# Altium schematic sheet MicroController.SchDoc
size A3; SheetNumber: 3; SheetTotal: 4
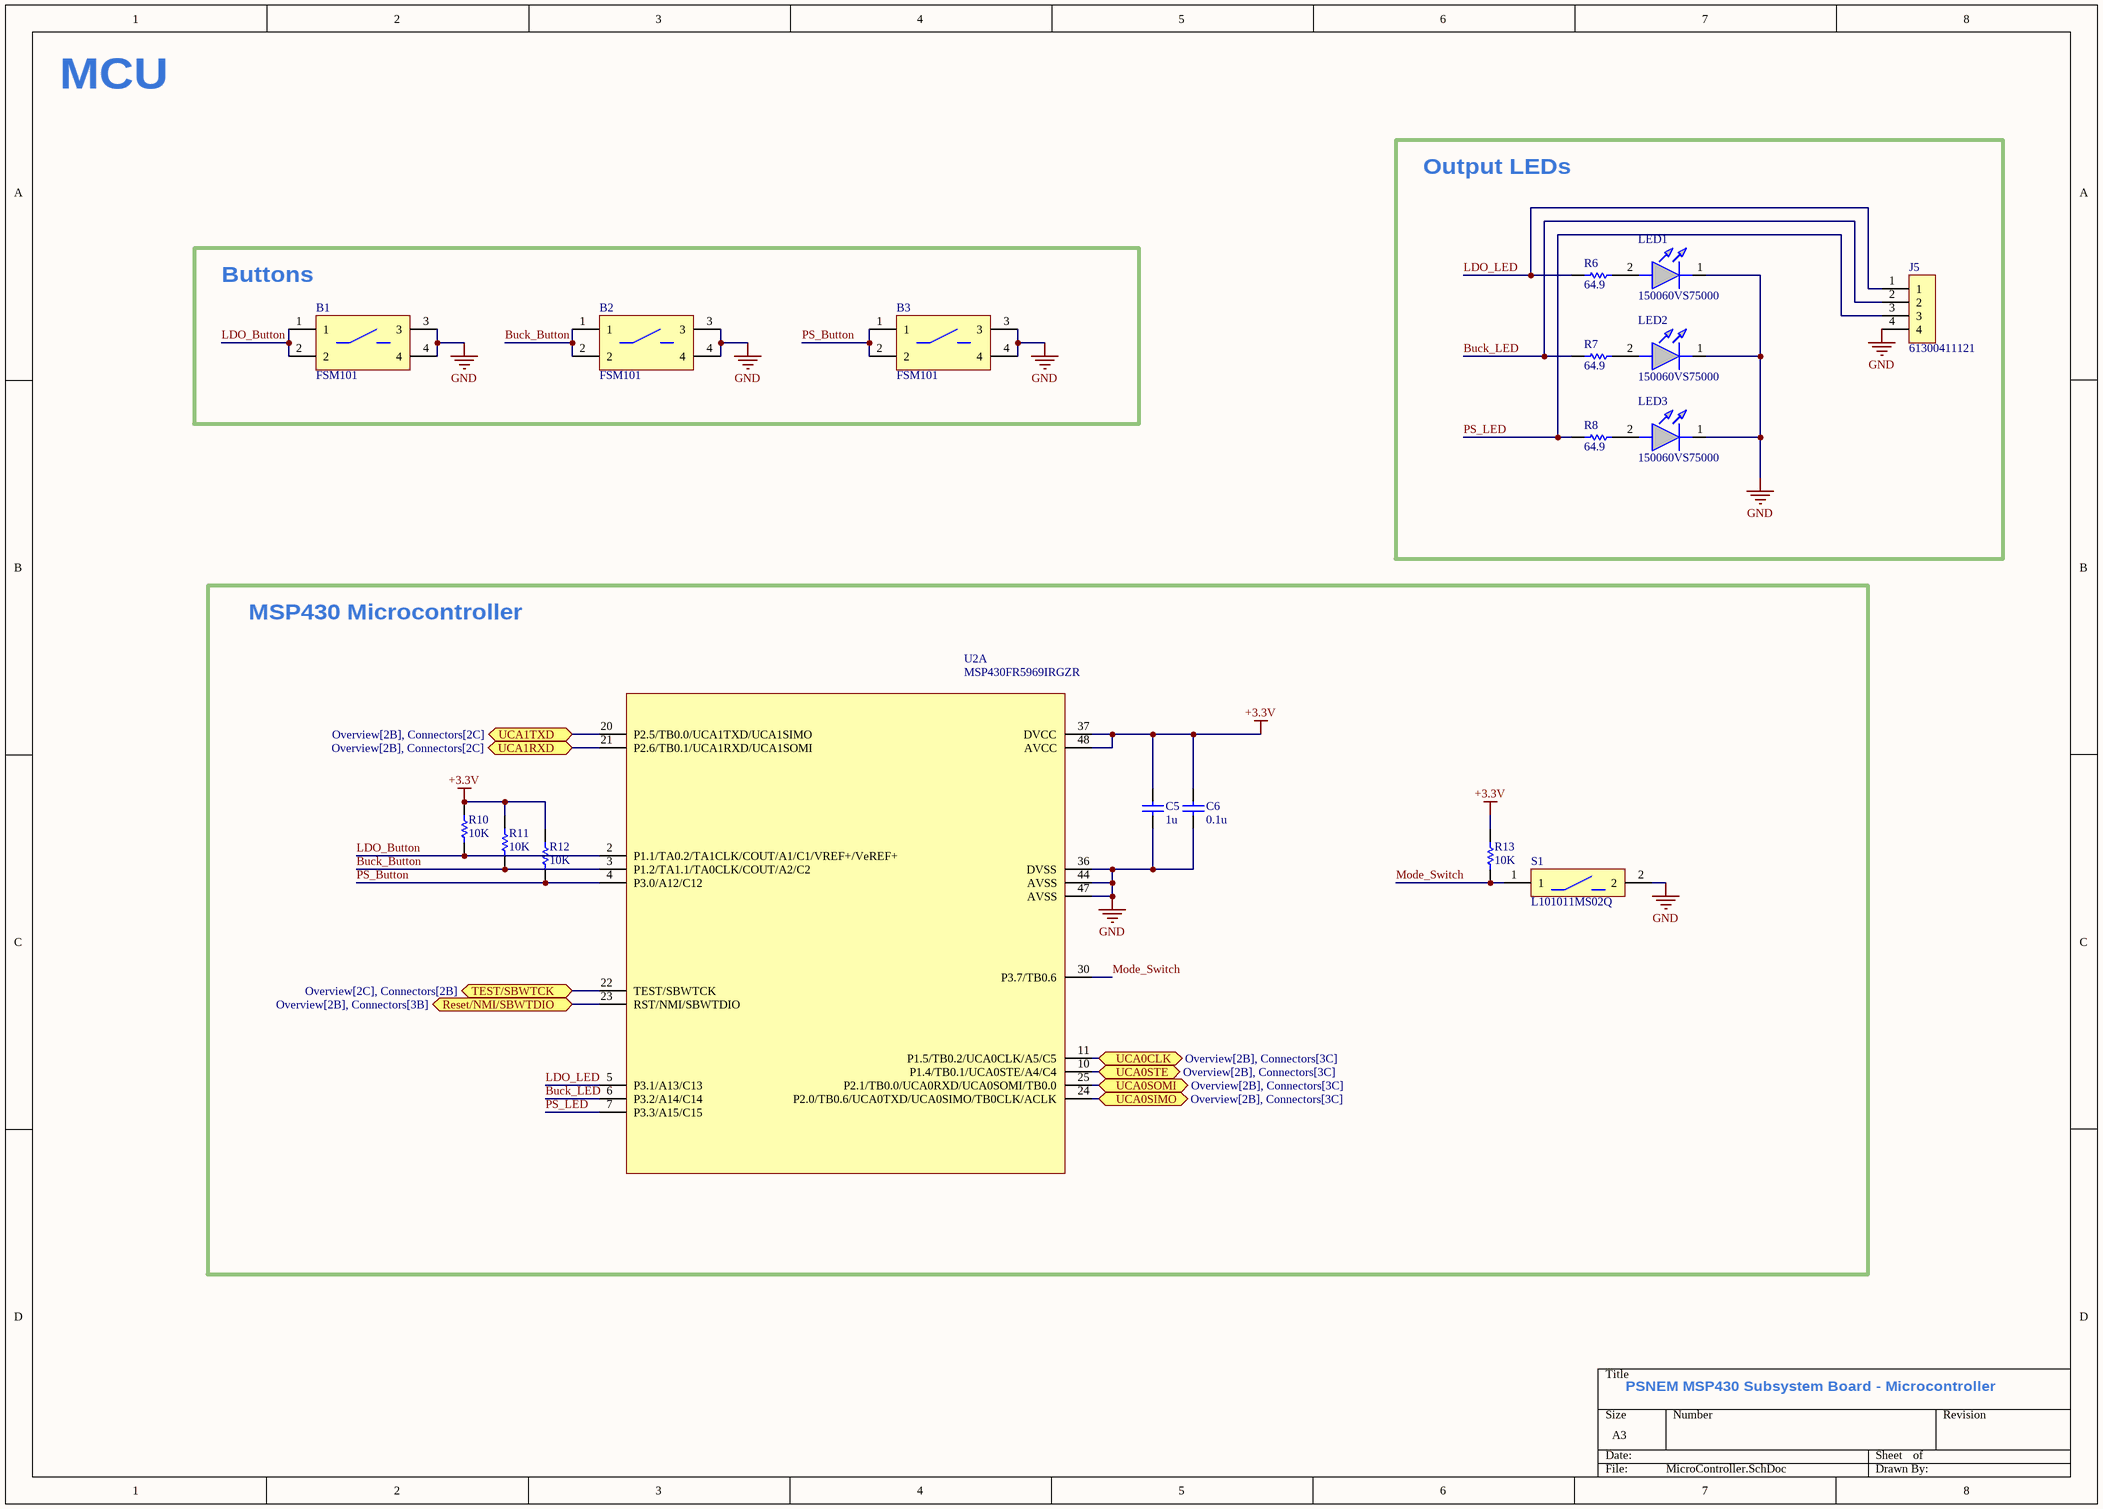
[diagram p0: MicroController.SchDoc]

## Parts
B1  FSM101  [FSM101]
B2  FSM101  [FSM101]
B3  FSM101  [FSM101]
C5  1u  [0805 Cap]
C6  0.1u  [0805 Cap]
J5  61300411121  [61300411121]
LED1  150060VS75000  [150060VS75000]
LED2  150060VS75000  [150060VS75000]
LED3  150060VS75000  [150060VS75000]
R6  64.9  [RESC1608X06N]
R7  64.9  [RESC1608X06N]
R8  64.9  [RESC1608X06N]
R10  10K  [RESC1608X06N]
R11  10K  [RESC1608X06N]
R12  10K  [RESC1608X06N]
R13  10K  [RESC1608X06N]
S1  L101011MS02Q  [L101011MS02Q]
U2  MSP430FR5969IRGZR  [MSP430FR5969IRGZR]  (part A of 2)

## Blocks framed on the sheet
Output LEDs: J5 LED1-LED3 R6-R8
Buttons: B1-B3
MSP430 Microcontroller: C5 C6 R10-R13 S1 U2

## Ports
Reset/NMI/SBWTDIO (bidir, see Overview[2B], Connectors[3B]), TEST/SBWTCK (bidir, see Overview[2C], Connectors[2B]), UCA0CLK (bidir, see Overview[2B], Connectors[3C]), UCA0SIMO (bidir, see Overview[2B], Connectors[3C]), UCA0SOMI (bidir, see Overview[2B], Connectors[3C]), UCA0STE (bidir, see Overview[2B], Connectors[3C]), UCA1RXD (bidir, see Overview[2B], Connectors[2C]), UCA1TXD (bidir, see Overview[2B], Connectors[2C])

## Nets
+3.3V: C5.2 C6.2 R10.2 R11.2 R12.2 R13.2 U2.37(DVCC) U2.48(AVCC)
GND: B1.3 B1.4 B2.3 B2.4 B3.3 B3.4 C5.1 C6.1 J5.4 LED1.1(K) LED2.1(K) LED3.1(K) S1.2 U2.36(DVSS) U2.44(AVSS) U2.47(AVSS)
Buck_Button: B2.1 B2.2 R11.1 U2.3(P1.2/TA1.1/TA0CLK/COUT/A2/C2)
Buck_LED: J5.2 R7.1 U2.6(P3.2/A14/C14)
LDO_Button: B1.1 B1.2 R10.1 U2.2(P1.1/TA0.2/TA1CLK/COUT/A1/C1/VREF+/VeREF+)
LDO_LED: J5.1 R6.1 U2.5(P3.1/A13/C13)
Mode_Switch: R13.1 S1.1 U2.30(P3.7/TB0.6)
PS_Button: B3.1 B3.2 R12.1 U2.4(P3.0/A12/C12)
PS_LED: J5.3 R8.1 U2.7(P3.3/A15/C15)
Reset/NMI/SBWTDIO: U2.23(RST/NMI/SBWTDIO) ; port Reset/NMI/SBWTDIO
TEST/SBWTCK: U2.22(TEST/SBWTCK) ; port TEST/SBWTCK
UCA0CLK: U2.11(P1.5/TB0.2/UCA0CLK/A5/C5) ; port UCA0CLK
UCA0SIMO: U2.24(P2.0/TB0.6/UCA0TXD/UCA0SIMO/TB0CLK/ACLK) ; port UCA0SIMO
UCA0SOMI: U2.25(P2.1/TB0.0/UCA0RXD/UCA0SOMI/TB0.0) ; port UCA0SOMI
UCA0STE: U2.10(P1.4/TB0.1/UCA0STE/A4/C4) ; port UCA0STE
UCA1RXD: U2.21(P2.6/TB0.1/UCA1RXD/UCA1SOMI) ; port UCA1RXD
UCA1TXD: U2.20(P2.5/TB0.0/UCA1TXD/UCA1SIMO) ; port UCA1TXD
NetLED1_2: LED1.2(A) R6.2
NetLED2_2: LED2.2(A) R7.2
NetLED3_2: LED3.2(A) R8.2

## Notes on the sheet
- MCU
- PSNEM MSP430 Subsystem Board - Microcontroller

## Library data of the parts
B1-B3 = FSM101: Tactile Switch SPST-NO Top Actuated Through Hole
C5 = CC0805KKX7R7BB105: 1 µF ±10% 16V Ceramic Capacitor X7R 0805 (2012 Metric); value: 1u
C6 = CC0805KRX7R9BB104: 0.1 µF ±10% 50V Ceramic Capacitor X7R 0805 (2012 Metric); value: 0.1u
J5 = 61300411121: Connector Header Through Hole 4 position 0.100" (2.54mm)
LED1-LED3 = 150060VS75000: LED GREEN CLEAR 0603 SMD
R6-R8 = ERA-3AEB64R9V: Thin Film Resistors - SMD 0603 64.9ohm 0.1% 25ppm; value: 64.9
R10-R13 = CRCW060310K0FKEAHP: RES SMD 10K OHM 1% 1/3W 0603; value: 10K
S1 = L101011MS02Q: SWITCH SLIDE SPST 4A 125V
U2 = MSP430FR5969IRGZR: MSP430 CPUXV2 MSP430™ FRAM Microcontroller IC 16-Bit 16MHz 64KB (64K x 8) FRAM 48-VQFN (7x7)